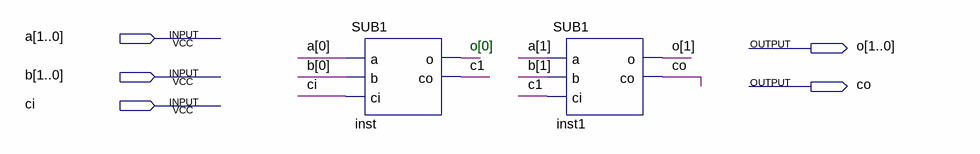
[diagram p0: schematic sheet]
// Quartus schematic SUB2.bdf as structural Verilog: 2 symbols, 5 pins
module SUB2 (
  input  [1:0] a,
  input  [1:0] b,
  input  ci,
  output [1:0] o,
  output co
);

  wire c1;

  SUB1 inst (.a(a[0]), .b(b[0]), .ci(ci), .o(o[0]), .co(c1));
  SUB1 inst1 (.a(a[1]), .b(b[1]), .ci(c1), .o(o[1]), .co(co));

  // Notes on the sheet:
  //   o[0]
endmodule
